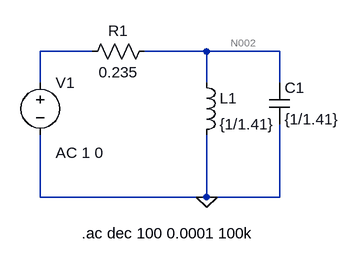
[diagram p0: schematic Draft3.asc]
Draft3.asc, the LTspice schematic file:
Version 4
SHEET 1 880 680
WIRE 160 96 80 96
WIRE 336 96 240 96
WIRE 448 96 336 96
WIRE 80 144 80 96
WIRE 336 144 336 96
WIRE 448 144 448 96
WIRE 80 320 80 224
WIRE 336 320 336 224
WIRE 336 320 80 320
WIRE 448 320 448 208
WIRE 448 320 336 320
FLAG 336 320 0
SYMBOL voltage 80 128 R0
WINDOW 123 24 124 Left 2
WINDOW 39 0 0 Left 0
SYMATTR InstName V1
SYMATTR Value ""
SYMATTR Value2 AC 1 0
SYMBOL res 256 80 R90
WINDOW 0 0 56 VBottom 2
WINDOW 3 32 56 VTop 2
SYMATTR InstName R1
SYMATTR Value 0.235
SYMBOL ind 320 128 R0
SYMATTR InstName L1
SYMATTR Value {1/1.41}
SYMBOL cap 432 144 R0
SYMATTR InstName C1
SYMATTR Value {1/1.41}
TEXT 144 376 Left 2 !.ac dec 100 0.0001 100k

The netlist it stands for:
* Draft3.asc
V1 N001 0 AC 1 0
R1 N002 N001 0.235
L1 N002 0 {1/1.41}
C1 N002 0 {1/1.41}
.ac dec 100 0.0001 100k
.backanno
.end

* Results of the author's LTspice run, read from the files saved beside the schematic
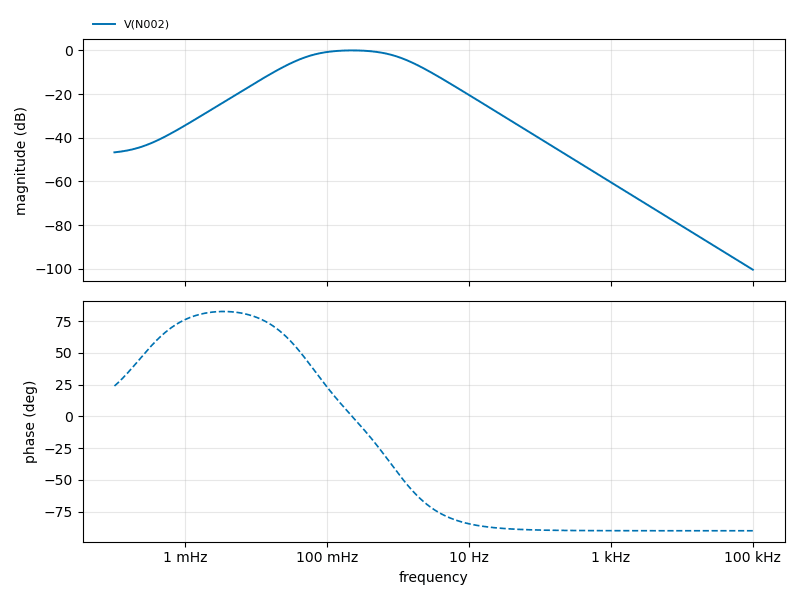
[diagram p1: AC Analysis of Draft3.asc, plotted from the saved traces]
* AC Analysis, 1 run:
*   V(N002): -46.67 dB at 100 µHz, -100.40 dB at 100 kHz, peak -0.00 dB at 223.9 mHz, 3 dB below the peak at 50.3 mHz and 1.005 Hz